# Altium schematic sheet 12_fit_POW.SchDoc
size B; SheetNumber: 2; SheetTotal: 3
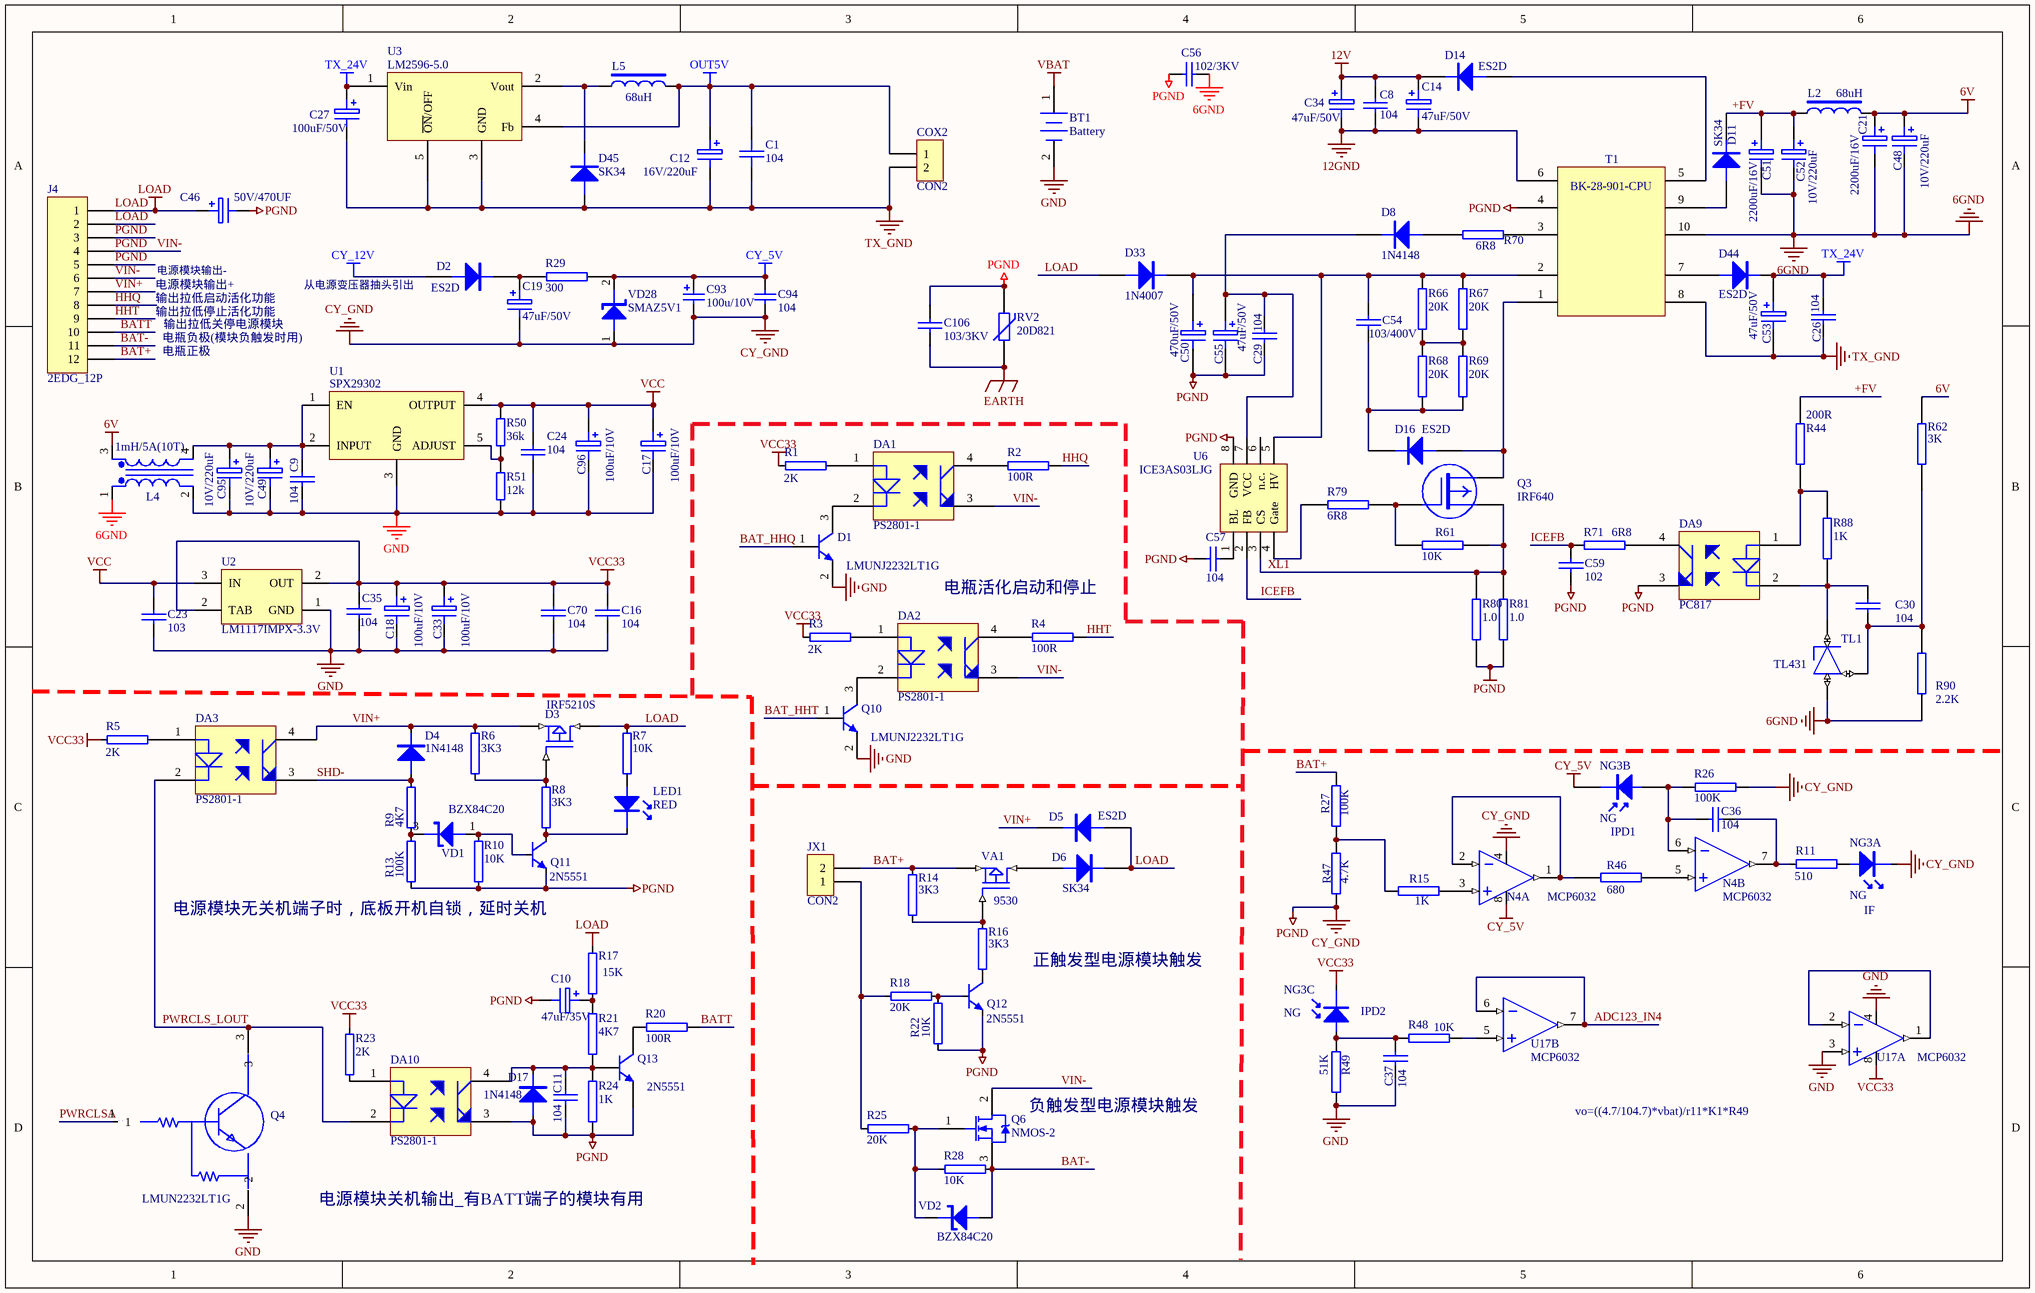
[diagram p0: 12_fit_POW.SchDoc]

## Parts
BT1  Battery  [3.3VBAT]
C1  104  [C1206]
C8  104  [CBB104]
C9  104  [CBB104]
C10  47uF/35V  [47u/50V]
C11  104  [C1206]
C12  16V/220uF  [钽电解C型EC6032]
C14  47uF/50V  [47u/50V]
C16  104  [C1206]
C17  100uF/10V  [钽电容B型3528]
C18  100uF/10V  [钽电容B型3528]
C19  47uF/50V  [47u/50V]
C21  2200uF/16V  [470u/63V]
C23  103  [C1206]
C24  104  [C1206]
C26  104  [C1206]
C27  100uF/50V  [SL-H贴片铝电解8mm]
C29  104  [C1206]
C30  104  [CBB104]
C33  100uF/10V  [钽电容B型3528]
C34  47uF/50V  [47u/50V]
C35  104  [C1206]
C36  104  [C1206]
C37  104  [C1206]
C46  50V/470UF  [470u/63V]
C48  10V/220uF  [钽电解C型EC6032]
C49  10V/220uF  [钽电解C型EC6032]
C50  470uF/50V  [470u/63V]
C51  2200uF/16V  [470u/63V]
C52  10V/220uF  [钽电解C型EC6032]
C53  47uF/50V  [47u/50V]
C54  103/400V  [CAP_HV_8]
C55  47uF/50V  [47u/50V]
C56  102/3KV  [CAP_HV_8]
C57  104  [C1206]
C59  102  [C1206]
C70  104  [C1206]
C93  100u/10V  [钽电容B型3528]
C94  104  [C1206]
C95  10V/220uF  [钽电解C型EC6032]
C96  100uF/10V  [钽电容B型3528]
C106  103/3KV  [CAP_HV_8]
COX2  CON2  [5569_2P_4.2直]
D1  LMUNJ2232LT1G  [SOT-23]
D2  ES2D  [DO-214AA]
D3  IRF5210S  [TO-220-SRQ]
D4  1N4148  [SMT_4148]
D5  ES2D  [DO-214AA]
D6  SK34  [DO-214AA]
D8  1N4148  [SMT_4148]
D11  SK34  [DO-214AA]
D14  ES2D  [DO-214AA]
D16  ES2D  [DO-214AA]
D17  1N4148  [SMT_4148]
D33  1N4007  [DO-214AA]
D44  ES2D  [DO-214AA]
D45  SK34  [DO-214AA]
DA1  PS2801-1  [SO-4]
DA2  PS2801-1  [SO-4]
DA3  PS2801-1  [SO-4]
DA9  PC817  [dip4]
DA10  PS2801-1  [SO-4]
J4  2EDG_12P  [XR_POWER5.08_12_弯]
JX1  CON2  [5569_2P_4.2直]
L2  68uH  [L680-TP]
L4  1mH/5A(10T)  [EMI_22_3mH]
L5  68uH  [L680-TP]
LED1  RED  [LED1206]
N4  MCP6032  [SO8]  (parts A,B of 2)
NG3  NG  [DIP8W]  (parts A,B,C of 3)
Q3  IRF640  [TO220-IRF540]
Q4  LMUN2232LT1G  [SOT-23]
Q6  NMOS-2  [TO220-IRF540]
Q10  LMUNJ2232LT1G  [SOT-23]
Q11  2N5551  [SOT-23]
Q12  2N5551  [SOT-23]
Q13  2N5551  [SOT-23]
R1  2K  [R1206]
R2  100R  [R1206]
R3  2K  [R1206]
R4  100R  [R1206]
R5  2K  [R1206]
R6  3K3  [R1206]
R7  10K  [R1206]
R8  3K3  [R1206]
R9  4K7  [R1206]
R10  10K  [R1206]
R11  510  [R1206]
R13  100K  [R1206]
R14  3K3  [R1206]
R15  1K  [R1206]
R16  3K3  [R1206]
R17  15K  [R1206]
R18  20K  [R1206]
R20  100R  [R1206]
R21  4K7  [R1206]
R22  10K  [R1206]
R23  2K  [R1206]
R24  1K  [R1206]
R25  20K  [R1206]
R26  100K  [R1206]
R27  100K  [R1206]
R28  10K  [R1206]
R29  300  [R2512]
R44  200R  [R1206]
R46  680  [R1206]
R47  4.7K  [R1206]
R48  10K  [R1206]
R49  51K  [R1206]
R50  36k  [R1206]
R51  12k  [R1206]
R61  10K  [R1206]
R62  3K  [R1206]
R66  20K  [R1206]
R67  20K  [R1206]
R68  20K  [R1206]
R69  20K  [R1206]
R70  6R8  [R1206]
R71  6R8  [R1206]
R79  6R8  [R1206]
R80  1.0  [R2512]
R81  1.0  [R2512]
R88  1K  [R1206]
R90  2.2K  [R1206]
RV2  20D821  [20D301]
T1  BK-28-901-CPU  [DC24S15]
TL1  TL431  [SOT-23]
U1  SPX29302  [TO-263-5]
U2  LM1117IMPX-3.3V  [SOT223]
U3  LM2596-5.0  [TO-263-5]
U6  ICE3AS03LJG  [SO8]
U17  MCP6032  [SO8]  (parts A,B of 2)
VA1  9530  [TO220-IRF540]
VD1  BZX84C20  [SOT-23]
VD2  BZX84C20  [SOT-23]
VD28  SMAZ5V1  [DO-214AC]

## Nets
6GND: C21.2 C48.2 C51.2 C52.2 C56.2 L4.1(Pri+) R90.1 T1.10 TL1.3(A)
6V: C21.1 C48.1 L2.2 L4.3(Sec+) R62.2
12GND: C8.2 C14.2 C34.2 T1.6
12V: C8.1 C14.1 C34.1 D14.2(K)
CY_5V: C93.1 C94.2 N4.8 NG3.3(K) R29.1 VD28.2
CY_12V: D2.1(A)
EARTH: C106.1 RV2.1
GND: BT1.2(-) C9.2 C16.1 C17.2 C18.2 C23.2 C24.1 C33.2 C35.2 C37.2 C49.2 C70.1 C95.2 C96.2 D1.2(E) L4.2(Pri-) Q4.2 Q10.2(E) R49.1 R51.1 U1.3(GND) U2.1(GND) U17.3 U17.4
LOAD: C46.1 D3.2(D) D5.1(A) D6.2(K) D33.1(A) J4.1 J4.2 R7.2 R17.2
OUT5V: C1.2 C12.1 COX2.1 L5.2 U3.4(Fb)
PGND: C10.2 C11.1 C19.2 C29.1 C46.2 C50.2 C55.2 C56.1 C57.1 C59.1 C93.2 C94.1 C106.2 D17.1(A) DA1.3 DA2.3 DA9.3 DA10.3 J4.3 J4.4 J4.5 J4.6 N4.4 NG3.1(K) Q6.2(D) Q11.2(E) Q12.2(E) Q13.2(E) R10.2 R13.2 R22.1 R24.1 R26.1 R47.1 R80.1 R81.1 RV2.2 T1.4 U6.8(GND) VD28.1  [also labelled CY_GND, VIN-]
TX_24V: C26.1 C27.1 C53.1 D44.2(K) U3.1(Vin)
TX_GND: C1.1 C12.2 C26.2 C27.2 C53.2 COX2.2 D45.1 T1.8 U3.3(GND) U3.5(~{ON}/OFF)
VBAT: BT1.1(+)
VCC: C17.1 C23.1 C24.2 C96.1 R50.1 U1.4(OUTPUT) U2.3(IN)
VCC33: C16.2 C18.1 C33.1 C35.1 C70.2 NG3.6(K) R1.2 R3.2 R5.2 R23.1 U2.2(OUT) U17.8
+FV: C51.1 C52.1 D11.2(K) L2.1 R44.2
ADC123_IN4: U17.6 U17.7
BAT+: J4.12 JX1.2 R14.2 R27.2 VA1.3(S)
BAT-: J4.11 Q6.3(S) R28.1 VD2.1
BAT_HHQ: D1.1(B)
BAT_HHT: Q10.1(B)
BATT: J4.10 R20.1
HHQ: J4.8 R2.1
HHT: J4.9 R4.1
ICEFB: C59.2 R71.1 U6.2(FB)
PWRCLS_LOUT: DA3.2 DA10.2 Q4.3
PWRCLSA: Q4.1
SHD-: D4.1(A) DA3.3 R9.2
VIN+: D3.3(S) D4.2(K) D5.2(K) DA3.4 J4.7 R6.2
XL1: Q3.3(S) R61.1 R80.2 R81.2 U6.3(CS)
NetC9_1: C9.1 C49.1 C95.1 L4.4(Sec-) U1.1(EN) U1.2(INPUT)
NetC10_1: C10.1 R17.1 R21.2
NetC11_2: C11.2 D17.2(K) DA10.4 Q13.1(B) R21.1 R24.2
NetC19_1: C19.1 D2.2(K) R29.2
NetC29_2: C29.2 C55.1 D8.2(K) U6.7(VCC)
NetC30_1: C30.1 DA9.2 R88.1 TL1.1(K)
NetC30_2: C30.2 R62.1 R90.2 TL1.2(R)
NetC36_1: C36.1 N4.6 NG3.4(A) R26.2
NetC36_2: C36.2 N4.7 R11.2
NetC37_1: C37.1 NG3.5(A) R48.2 R49.2
NetC50_1: C50.1 C54.2 D33.2(K) R66.2 R67.2 T1.2 U6.5(HV)
NetC54_1: C54.1 D16.2(K) R68.1 R69.1
NetC57_2: C57.2 U6.1(BL)
NetD1_3: D1.3(C) DA1.2
NetD3_1: D3.1(G) R6.1 R8.2
NetD6_1: D6.1(A) VA1.2(D)
NetD8_1: D8.1(A) R70.1
NetD11_1: D11.1(A) T1.9
NetD14_1: D14.1(A) T1.5
NetD16_1: D16.1(A) Q3.2(D) T1.1
NetD44_1: D44.1(A) T1.7
NetD45_2: D45.2 L5.1 U3.2(Vout)
NetDA1_1: DA1.1 R1.1
NetDA1_4: DA1.4 R2.2
NetDA2_1: DA2.1 R3.1
NetDA2_2: DA2.2 Q10.3(C)
NetDA2_4: DA2.4 R4.2
NetDA3_1: DA3.1 R5.1
NetDA9_1: DA9.1 R44.1 R88.2
NetDA9_4: DA9.4 R71.2
NetDA10_1: DA10.1 R23.2
NetJX1_1: JX1.1 R18.2 R25.2
NetLED1_A: LED1.A R7.1
NetLED1_K: LED1.K Q11.3(C) R8.1
NetN4_1: N4.1 N4.2 R46.1
NetN4_3: N4.3 R15.1
NetN4_5: N4.5 R46.2
NetNG3_2: NG3.2(A) R11.1
NetQ3_1: Q3.1(G) R61.2 R79.1
NetQ6_1: Q6.1(G) R25.1 R28.2 VD2.3
NetQ11_1: Q11.1(B) R10.1 VD1.1
NetQ12_1: Q12.1(B) R18.1 R22.2
NetQ12_3: Q12.3(C) R16.1
NetQ13_3: Q13.3(C) R20.2
NetR9_1: R9.1 R13.1 VD1.3
NetR14_1: R14.1 R16.2 VA1.1(G)
NetR15_2: R15.2 R27.1 R47.2
NetR48_1: R48.1 U17.5
NetR50_2: R50.2 R51.2 U1.5(ADJUST)
NetR66_1: R66.1 R67.1 R68.2 R69.2
NetR70_2: R70.2 T1.3
NetR79_2: R79.2 U6.4(Gate)
NetU17_1: U17.1 U17.2

Not connected (* = marked no-connect by the designer): U6 6(n.c.)

## Notes on the sheet
- 电源模块输出+
- 输出拉低启动活化功能
- 电源模块输出-
- 从电源变压器抽头引出
- 输出拉低停止活化功能
- 电瓶正极
- 电瓶负极(模块负触发时用)
- 输出拉低关停电源模块
- 电瓶活化启动和停止
- IPD1
- 电源模块无关机端子时，底板开机自锁，延时关机
- 正触发型电源模块触发
- IF
- IPD2
- (near Q6) 负触发型电源模块触发
- vo=((4.7/104.7)*vbat)/r11*K1*R49
- 电源模块关机输出_有BATT端子的模块有用

## Library data of the parts
BT1 = Battery: Multicell Battery; Published: 24-Mar-1999; LatestRevisionDate: 17-Jul-2002; LatestRevisionNote: Re-released for DXP Platform.; PackageReference: BAT-2; Publisher: Altium Limited; PackageDescription: Battery; 2 Leads
C1 C8 C9 C11 C16 C23 C24 C26 C29 C30 C36 C37 C56 C57 C70 C106 = CAP: Capacitor
C10 C14 C19 C34 C46 C50 C51 C53 C55 = ELECTRO1: Electrolytic Capacitor
C12 C48 C49 C52 C95 = ELECTRO: Electrolytic Capacitor
C17 C18 C21 C27 C33 C96 = ELECTRO1
C35 C54 C59 = CAP
C93 = Cap Pol2: Polarized Capacitor (Axial); Value: 100pF; Published: 8-Jun-2000; LatestRevisionDate: 17-Jul-2002; LatestRevisionNote: Re-released for DXP Platform.; PackageReference: POLAR0.8; Publisher: Altium Limited; PackageDescription: Polarized Capacitor; 2 Leads
C94 = Cap: Capacitor; Value: 100pF; Published: 8-Jun-2000; LatestRevisionDate: 17-Jul-2002; LatestRevisionNote: Re-released for DXP Platform.; PackageReference: RAD-0.3; Publisher: Altium Limited; PackageDescription: Radial Cap, Thru-Hole; 2 Leads; 0.3 in Pin Spacing
COX2 JX1 = CON2: Connector
D1 Q10-Q13 = SOT-23 2SC3356-T1B-A    S/YS档: 三极管; ComponentLink1Description: 供应商链接; ComponentLink1URL: http://www.szlcsc.com/product/details_10189.html; Package: SOT-23; Supplier: LC; SuppliersPartNumber: C9659
D2 D4-D6 D8 D11 D14 D16 D17 D33 D44 = DIODE
D3 VA1 = MOSFET P
D45 = DIDOE: Diode
DA1-DA3 DA9 DA10 = TLP521-1
J4 = Header 12: Header, 12-Pin; LatestRevisionDate: 17-Jul-2002; LatestRevisionNote: Re-released for DXP Platform.; Publisher: Altium Limited
L2 L5 = INDUCTOR2
L4 = Trans Cupl: Transformer (Coupled Inductor Model); Published: 8-Jun-2000; LatestRevisionDate: 17-Jul-2002; LatestRevisionNote: Re-released for DXP Platform.; PackageReference: TRF_4; Publisher: Altium Limited; PackageDescription: Transformer; 4 Leads
LED1 = LED
N4 U17 = TL082
Q3 = MOSFET-P1
Q4 = T-NPN-LMUN2232LT1G-SOT23: Vceo=50V,Vcbo=50V,Ic=100mA,Hfe=15@Ic=5mA,R1=R2=4.7k; MFR: ROHM; Geometry.Height: 1.2mm; SN: 41100010; TYPE: NPN数字三极管; Value: DNI-LMUN2232LT1G; PCB DECAL: SOT23; MPN: LMUN2232LT1G; PCB Footprint: SOT-23
Q6 = NMOS-2: N-Channel Power MOSFET; Note: Pin 2 is electrically connected to pin 4.; Published: 8-Jun-2000; LatestRevisionDate: 17-Jul-2002; LatestRevisionNote: Re-released for DXP Platform.; DatasheetVersion: PD-9.814; PackageVersion: Feb-1997; PackageReference: TO-220AB; Publisher: Altium Limited; PackageDescription: TO, Thru-Hole, Vertical, Heatsink Mounted; 3 In-Line Leads; Pitch 2.54 mm; ComponentLink1Description: Manufacturer Link; ComponentLink1URL: http://www.irf.com/
R1-R11 R13-R18 R20-R29 R44 R46-R49 R61 R62 R66-R71 R79-R81 R88 R90 = RES2
R50 R51 = RES
RV2 = VARISTOR
T1 = DC24S15
U2 = LM1117IMPX-3.3: 800mA Low-Dropout Linear Regulator, 4-pin SOT-223; Manufacturer: National Semiconductor; PackageTopMarking: XYTT*N05B; PowerWise: N; CompType: LDO IC; Published: 1-Mar-2010; DatasheetVersion: Apr-2006; PackageVersion: revB, Apr-2003; PackageReference: MP04A; Publisher: Altium Limited; PackageDescription: Molded SOT-223, 6.50 x 3.56 x 1.6mm Body, 4 Lead, 2.3mm Pitch; PartNumber: LM1117IMPX-3.3; RoHS: N; PinCount: 4; Code_JEDEC: TO-261-AA; Code_IPC: SOT223-4; ComponentLink1Description: LM1117 Datasheet; ComponentLink1URL: http://www.national.com/ds/LM/LM1117.pdf; ComponentLink2Description: LM1117 Web Page; ComponentLink2URL: http://www.national.com/pf/LM/LM1117.html; ComponentLink3Description: MP04A Package Page; ComponentLink3URL: http://www.national.com/packaging/folders/mp04a.html
U3 = LM2596
VD1 VD2 VD28 = ZENER2